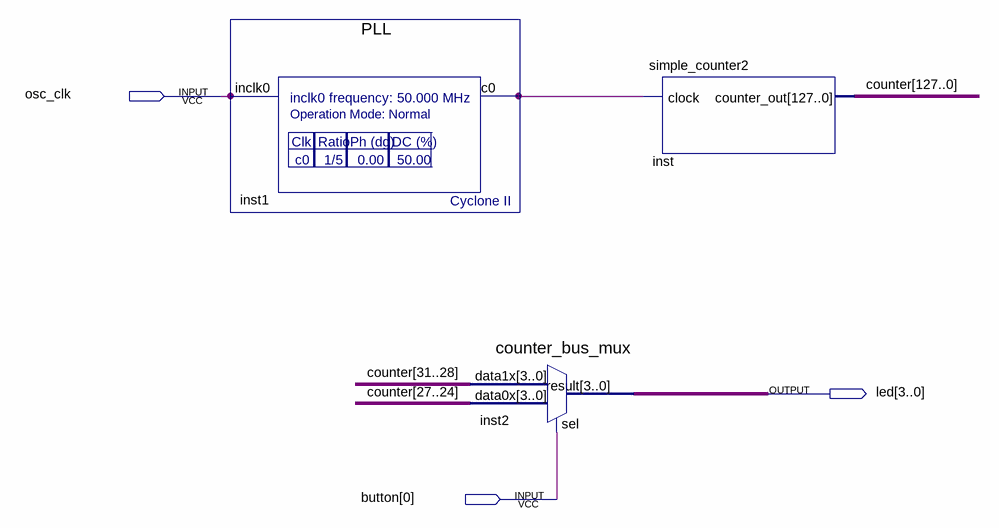
[diagram p0: schematic sheet]
// Quartus schematic 1st_Project_top.bdf as structural Verilog: 3 symbols, 3 pins
module \1st_Project_top  (
  input  osc_clk,
  input  [0:0] button,
  output [3:0] led
);

  wire inst1_c0;
  wire [127:0] counter;

  PLL inst1 (.inclk0(osc_clk), .c0(inst1_c0));
  counter_bus_mux inst2 (.data1x(counter[31:28]), .data0x(counter[27:24]), .sel(button[0]), .result(led));
  simple_counter2 inst (.clock(inst1_c0), .counter_out(counter));
endmodule
